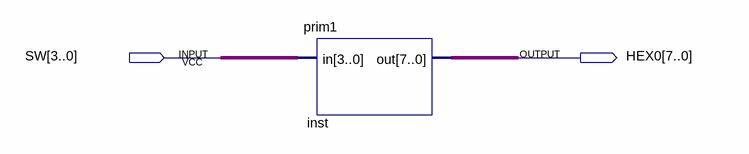
[diagram p0: schematic sheet]
// Quartus schematic main.bdf as structural Verilog: 1 symbols, 2 pins
module main (
  input  [3:0] SW,
  output [7:0] HEX0
);

  prim1 inst (.in(SW), .out(HEX0));
endmodule
